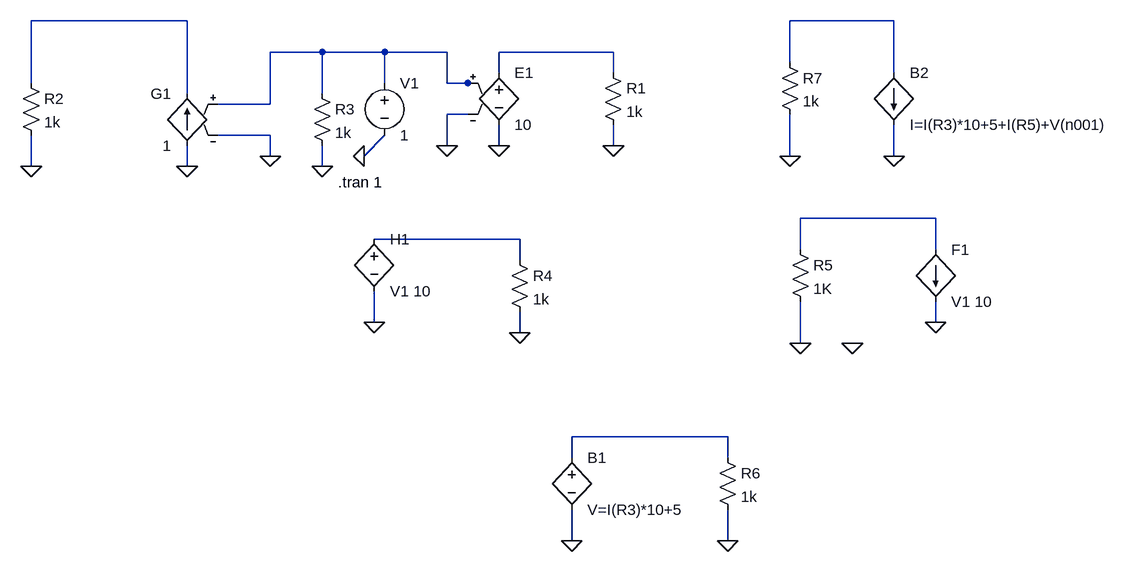
[diagram p0: schematic Draft5.asc]
Draft5.asc, the LTspice schematic file:
Version 4
SHEET 1 1012 868
WIRE -464 48 -704 48
WIRE 624 48 464 48
WIRE -256 96 -336 96
WIRE -160 96 -256 96
WIRE -64 96 -160 96
WIRE 192 96 16 96
WIRE 464 112 464 48
WIRE 16 128 16 96
WIRE 192 128 192 96
WIRE 624 128 624 48
WIRE -704 144 -704 48
WIRE -160 144 -160 96
WIRE -64 144 -64 96
WIRE -32 144 -64 144
WIRE -16 144 -32 144
WIRE -464 160 -464 48
WIRE -256 160 -256 96
WIRE -336 176 -336 96
WIRE -336 176 -416 176
WIRE -32 192 -64 192
WIRE -336 224 -416 224
WIRE -64 240 -64 192
WIRE 16 240 16 208
WIRE 192 240 192 208
WIRE -336 256 -336 224
WIRE -192 256 -160 224
WIRE 464 256 464 192
WIRE 624 256 624 208
WIRE -704 272 -704 224
WIRE -464 272 -464 240
WIRE -256 272 -256 240
WIRE 688 352 480 352
WIRE 48 384 -176 384
WIRE 480 400 480 352
WIRE 688 400 688 352
WIRE 48 416 48 384
WIRE -176 512 -176 464
WIRE 688 512 688 480
WIRE 48 528 48 496
WIRE 480 544 480 480
WIRE 368 688 128 688
WIRE 128 720 128 688
WIRE 368 720 368 688
WIRE 128 848 128 800
WIRE 368 848 368 800
FLAG 16 240 0
FLAG 192 240 0
FLAG -64 240 0
FLAG -192 256 0
FLAG -336 256 0
FLAG -464 272 0
FLAG -704 272 0
FLAG -256 272 0
FLAG -176 512 0
FLAG 48 528 0
FLAG 688 512 0
FLAG 480 544 0
FLAG 560 544 0
FLAG 368 848 0
FLAG 128 848 0
FLAG 464 256 0
FLAG 624 256 0
SYMBOL res 176 112 R0
SYMATTR InstName R1
SYMATTR Value 1k
SYMBOL voltage -160 128 R0
WINDOW 123 0 0 Left 0
WINDOW 39 0 0 Left 0
SYMATTR InstName V1
SYMATTR Value 1
SYMBOL e 16 112 R0
SYMATTR InstName E1
SYMATTR Value 10
SYMBOL g -464 144 M0
SYMATTR InstName G1
SYMATTR Value 1
SYMBOL res -720 128 R0
SYMATTR InstName R2
SYMATTR Value 1k
SYMBOL res -272 144 R0
SYMATTR InstName R3
SYMATTR Value 1k
SYMBOL h -176 368 R0
SYMATTR InstName H1
SYMATTR Value V1 10
SYMBOL res 32 400 R0
SYMATTR InstName R4
SYMATTR Value 1k
SYMBOL f 688 400 R0
SYMATTR InstName F1
SYMATTR Value V1 10
SYMBOL res 464 384 R0
SYMATTR InstName R5
SYMATTR Value 1K
SYMBOL bv 128 704 R0
SYMATTR InstName B1
SYMATTR Value V=I(R3)*10+5
SYMBOL res 352 704 R0
SYMATTR InstName R6
SYMATTR Value 1k
SYMBOL bi 624 128 R0
SYMATTR InstName B2
SYMATTR Value I=I(R3)*10+5+I(R5)+V(n001)
SYMBOL res 448 96 R0
SYMATTR InstName R7
SYMATTR Value 1k
TEXT -232 296 Left 2 !.tran 1

The netlist it stands for:
* Draft5.asc
R1 N004 0 1k
V1 N003 0 1
E1 N004 0 N003 0 10
G1 0 N001 N003 0 1
R2 N001 0 1k
R3 N003 0 1k
H1 N006 0 V1 10
R4 N006 0 1k
F1 N005 0 V1 10
R5 N005 0 1K
B1 N007 0 V=I(R3)*10+5
R6 N007 0 1k
B2 N002 0 I=I(R3)*10+5+I(R5)+V(n001)
R7 N002 0 1k
.tran 1
.backanno
.end